# EAGLE design QFN-24_to_DIP-24 (EAGLE 8.5.1)
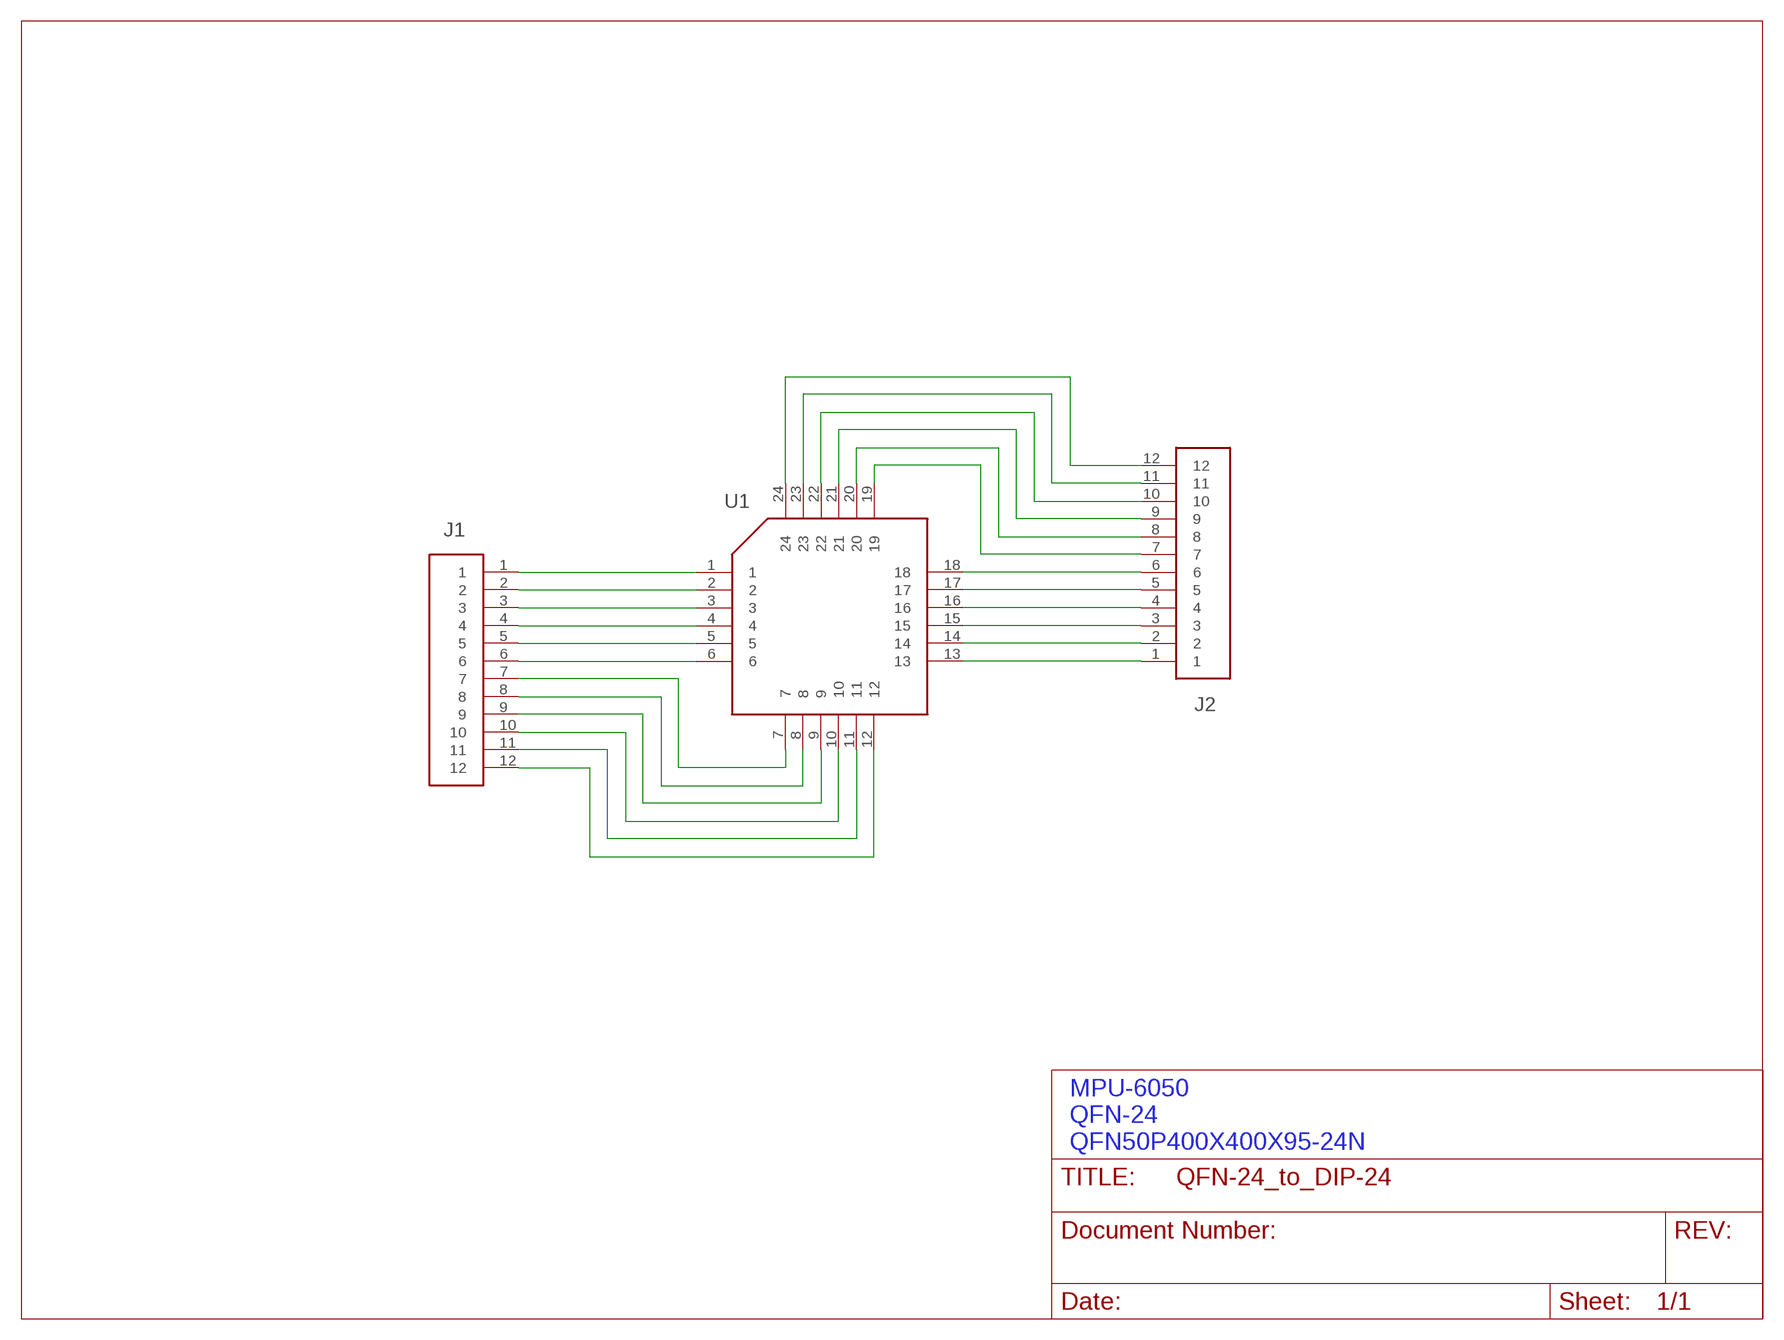
[diagram p0: schematic, sheet 1]

## Parts
J1  CONNECTOR_12  [68000-112HLF]
J2  CONNECTOR_12-NO_SQUARE  [68000-112HLF_NO_SQUARE]
U1  IC_GENERIC_24-QFN24-NO-EP  [QFN50P400X400X95-24N]

## Nets
N$1: J1.1 U1.1
N$2: J1.2 U1.2
N$3: J1.3 U1.3
N$4: J1.4 U1.4
N$5: J1.5 U1.5
N$6: J1.6 U1.6
N$7: J2.1 U1.13
N$8: J2.2 U1.14
N$9: J2.3 U1.15
N$10: J2.4 U1.16
N$11: J2.5 U1.17
N$12: J2.6 U1.18
N$13: J2.7 U1.19
N$14: J2.8 U1.20
N$15: J2.9 U1.21
N$16: J2.10 U1.22
N$17: J2.11 U1.23
N$18: J2.12 U1.24
N$19: J1.7 U1.7
N$20: J1.8 U1.8
N$21: J1.9 U1.9
N$22: J1.10 U1.10
N$23: J1.11 U1.11
N$24: J1.12 U1.12

## Notes on the sheet
- MPU-6050
  QFN-24 
  QFN50P400X400X95-24N

## Library data of the parts
J1 J2 = SnapEDA:CONNECTOR_12
U1 = SnapEDA:IC_GENERIC_24: RE the MPU-6050 - the package has an Exposed Pad, but the datasheet specifies not to solder it, and not to route traces under it: 11.4.2 Exposed Die Pad Precautions The MPU-60X0 has very low active and standby current consumption. The exposed die pad is not required for heat sinking, and should not be soldered to the PCB . Failure to adhere to this rule can induce performance changes due to package thermo - mechanical stress. There is no electrical connection between the pad and the CMOS. 11.4.3 Trace Routing Routing traces or vias under the gyro package such that they run under the exposed die pad is prohibited. Routed active signals may harmonical ly couple with the gyro MEMS devices, compromising gyro response.

## Board
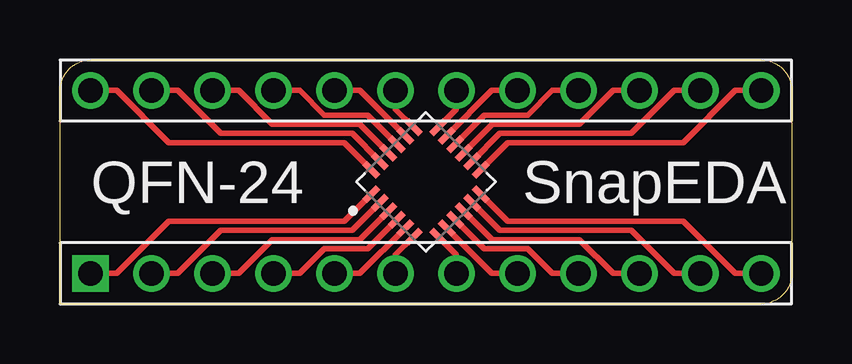
[diagram p1: board, top side]

Size 30.49 x 10.16 mm. Coordinates in mm from the lower left corner, seen from the top.
Outline: 1.3,10.16 29.22,10.16 arc-90 30.49,8.89 arc0 30.49,1.27 arc-90 29.22,0 0.01,0 arc0 0.01,8.89 arc-90 1.28,10.16
Copper layers (1*16): Top 0.035559375mm / dielectric 1.6mm / Bottom 0.035559375mm
Design rules "oshpark-2layer": minimum track width 6mil, minimum drill 10mil, track to track 6mil, track to pad 6mil, pad to pad 6mil, via to via 6mil, smd to smd 6mil, copper to edge 15mil, drill to drill 6mil, minimum pad ring 5mil, minimum via ring 5mil, stop-mask expansion 2.5mil, vias tented up to drill 0mil, thermal gap 10mil

### Footprints (pad centres in the part's own frame; a part is rotated, then mirrored left to right if it is on the bottom)
68000-112HLF = drill 1.016 square: 1 -13.97,0 | drill 1.016: 2 -11.43,0; 3 -8.89,0; 4 -6.35,0; 5 -3.81,0; 6 -1.27,0; 7 1.27,0; 8 3.81,0; 9 6.35,0; 10 8.89,0; 11 11.43,0; 12 13.97,0
68000-112HLF_NO_SQUARE = drill 1.016: 1 -13.97,0; 2 -11.43,0; 3 -8.89,0; 4 -6.35,0; 5 -3.81,0; 6 -1.27,0; 7 1.27,0; 8 3.81,0; 9 6.35,0; 10 8.89,0; 11 11.43,0; 12 13.97,0
QFN50P400X400X95-24N = smd 0.79 x 0.26: 1 -1.97,1.25; 2 -1.97,0.75; 3 -1.97,0.25; 4 -1.97,-0.25; 5 -1.97,-0.75; 6 -1.97,-1.25; 13 1.97,-1.25; 14 1.97,-0.75; 15 1.97,-0.25; 16 1.97,0.25; 17 1.97,0.75; 18 1.97,1.25 | smd 0.26 x 0.79: 7 -1.25,-1.97; 8 -0.75,-1.97; 9 -0.25,-1.97; 10 0.25,-1.97; 11 0.75,-1.97; 12 1.25,-1.97; 19 1.25,1.97; 20 0.75,1.97; 21 0.25,1.97; 22 -0.25,1.97; 23 -0.75,1.97; 24 -1.25,1.97

### Placement (x,y rotation side)
J1  15.25,1.27 0 top
J2  15.25,8.89 180 top
U1  15.25,5.08 45 top

### Tracks (layer width: path | path; a pad name or v marks a point on that pad's centre or on a via)
N$1
  Top 0.229: U1.1 11.84,3.44 4.54,3.44 2.36,1.27 J1.1
N$2
  Top 0.229: U1.2 12.17,3.06 6.69,3.06 4.9,1.27 J1.2
N$3
  Top 0.229: U1.3 12.49,2.68 8.85,2.68 7.44,1.27 J1.3
N$4
  Top 0.229: U1.4 12.82,2.3 11.01,2.3 9.98,1.27 J1.4
N$5
  Top 0.229: U1.5 12.5,1.27 J1.5
N$6
  Top 0.229: U1.6 13.98,2.04 J1.6
N$7
  Top 0.229: U1.13 18.65,6.72 25.96,6.72 28.13,8.89 J2.1
N$8
  Top 0.229: U1.14 18.33,7.1 23.8,7.1 25.59,8.89 J2.2
N$9
  Top 0.229: U1.15 18,7.48 21.64,7.48 23.05,8.89 J2.3
N$10
  Top 0.229: U1.16 17.68,7.86 19.48,7.86 20.51,8.89 J2.4
N$11
  Top 0.229: U1.17 18,8.89 J2.5
N$12
  Top 0.229: U1.18 16.52,8.12 J2.6
N$13
  Top 0.229: U1.19 13.98,8.12 J2.7
N$14
  Top 0.229: U1.20 12.5,8.89 J2.8
N$15
  Top 0.229: U1.21 12.82,7.86 11.01,7.86 9.98,8.89 J2.9
N$16
  Top 0.229: U1.22 12.49,7.48 8.85,7.48 7.44,8.89 J2.10
N$17
  Top 0.229: U1.23 12.17,7.1 6.69,7.1 4.9,8.89 J2.11
N$18
  Top 0.229: U1.24 11.84,6.72 4.54,6.72 2.36,8.89 J2.12
N$19
  Top 0.229: U1.7 16.52,2.04 J1.7
N$20
  Top 0.229: U1.8 18,1.27 J1.8
N$21
  Top 0.229: U1.9 17.68,2.3 19.48,2.3 20.51,1.27 J1.9
N$22
  Top 0.229: U1.10 18,2.68 21.64,2.68 23.05,1.27 J1.10
N$23
  Top 0.229: U1.11 18.33,3.06 23.8,3.06 25.59,1.27 J1.11
N$24
  Top 0.229: U1.12 18.65,3.44 25.96,3.44 28.13,1.27 J1.12

### Text on the board
tPlace: QFN-24 | SnapEDA